# Altium schematic sheet DE-211024_2.SchDoc: RelayBoard
size A4; Author: eldar6776@hotmail.com; DrawnBy: Eldar Dedic; Organization: JUBERA d.o.o.; Address1: Braće Mulić 81; Address2: 71000 Sarajevo; Address3: Federacija BiH; Address4: Bosna i Hercegovina; DocumentNumber: DE-211024; Revision: 001; SheetNumber: 2; SheetTotal: 3; SPICEModelCacheBVBUIEPD: <root> / <DocumentId>BVBUIEPD</DocumentId> / </root>
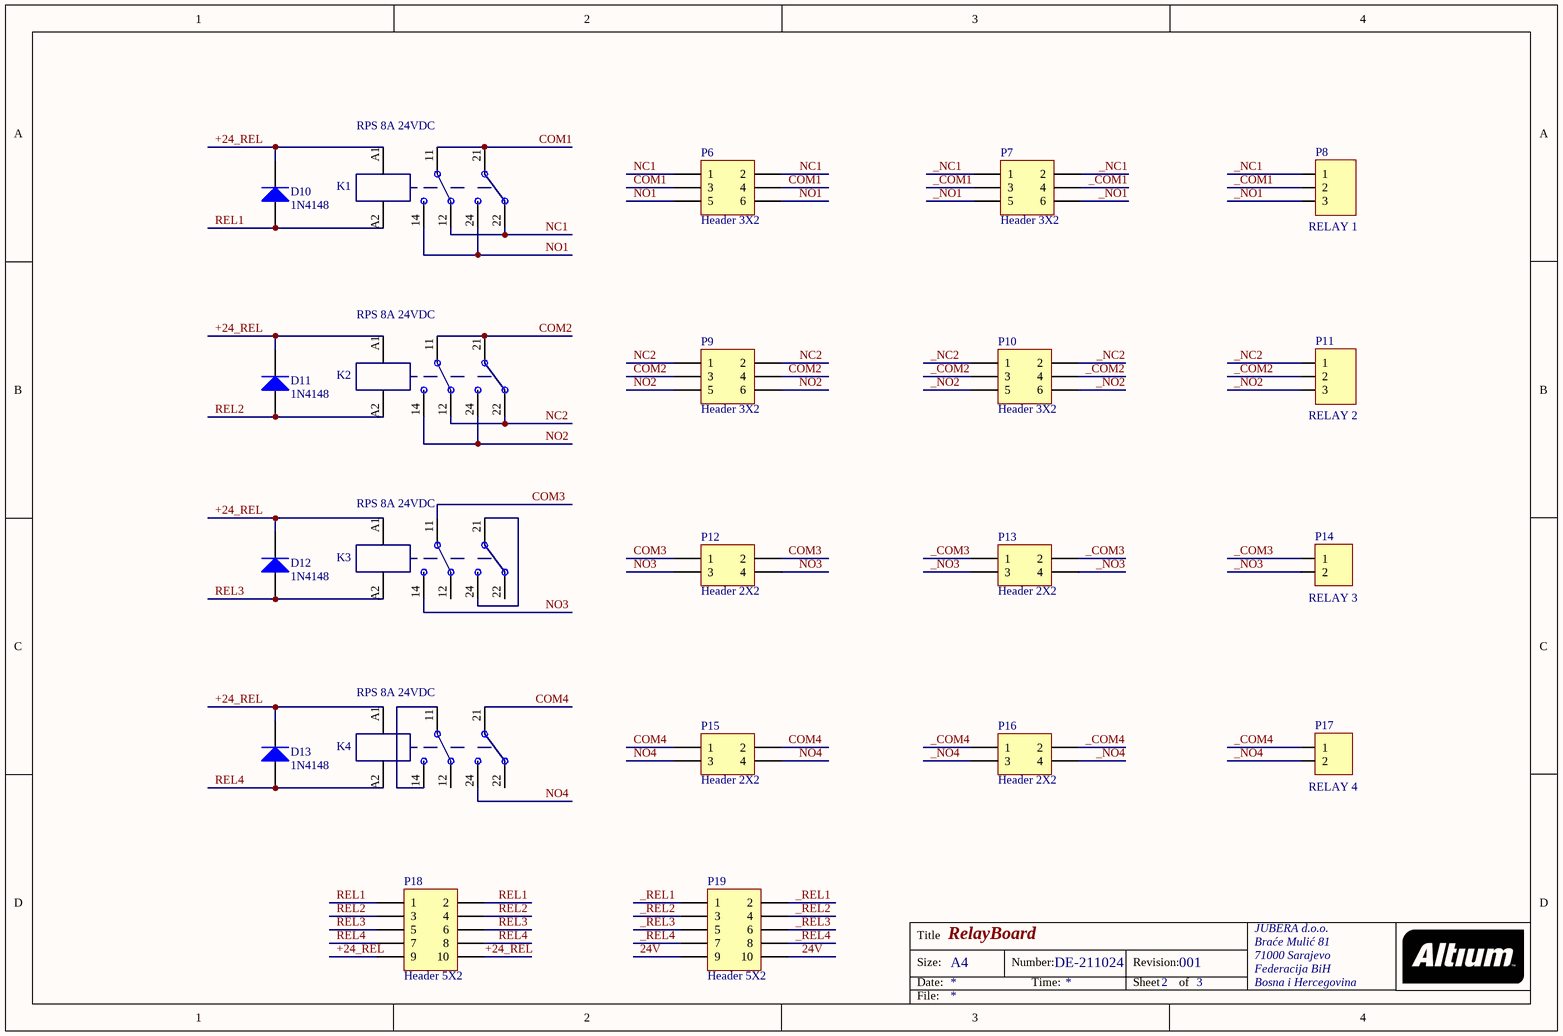
[diagram p0: DE-211024_2.SchDoc]

## Parts
D10  1N4148  [SOD323]
D11  1N4148  [SOD323]
D12  1N4148  [SOD323]
D13  1N4148  [SOD323]
K1  RPS 8A 24VDC  [RPS 2CO 8A 24V]
K2  RPS 8A 24VDC  [RPS 2CO 8A 24V]
K3  RPS 8A 24VDC  [RPS 2CO 8A 24V]
K4  RPS 8A 24VDC  [RPS 2CO 8A 24V]
P6  Header 3X2  [HDR2X3]
P7  Header 3X2  [HDR2X3]
P8  RELAY 1  [TERMINAL BLOK 3]
P9  Header 3X2  [HDR2X3]
P10  Header 3X2  [HDR2X3]
P11  RELAY 2  [TERMINAL BLOK 3]
P12  Header 2X2  [HDR2X2]
P13  Header 2X2  [HDR2X2]
P14  RELAY 3  [TERMINAL BLOK 2]
P15  Header 2X2  [HDR2X2]
P16  Header 2X2  [HDR2X2]
P17  RELAY 4  [TERMINAL BLOK 2]
P18  Header 5X2  [HDR2X5]
P19  Header 5X2  [HDR2X5]

## Nets
24V: P19.9 P19.10
+24_REL: D10.1(K) D11.1(K) D12.1(K) D13.1(K) K1.A1 K2.A1 K3.A1 K4.A1 P18.9 P18.10
_COM1: P7.3 P7.4 P8.2
_COM2: P10.3 P10.4 P11.2
_COM3: P13.1 P13.2 P14.1
_COM4: P16.1 P16.2 P17.1
_NC1: P7.1 P7.2 P8.1
_NC2: P10.1 P10.2 P11.1
_NO1: P7.5 P7.6 P8.3
_NO2: P10.5 P10.6 P11.3
_NO3: P13.3 P13.4 P14.2
_NO4: P16.3 P16.4 P17.2
_REL1: P19.1 P19.2
_REL2: P19.3 P19.4
_REL3: P19.5 P19.6
_REL4: P19.7 P19.8
COM1: K1.11 K1.21 P6.3 P6.4
COM2: K2.11 K2.21 P9.3 P9.4
COM3: K3.11 P12.1 P12.2
COM4: K4.21 P15.1 P15.2
NC1: K1.12 K1.22 P6.1 P6.2
NC2: K2.12 K2.22 P9.1 P9.2
NO1: K1.14 K1.24 P6.5 P6.6
NO2: K2.14 K2.24 P9.5 P9.6
NO3: K3.14 P12.3 P12.4
NO4: K4.24 P15.3 P15.4
REL1: D10.2(A) K1.A2 P18.1 P18.2
REL2: D11.2(A) K2.A2 P18.3 P18.4
REL3: D12.2(A) K3.A2 P18.5 P18.6
REL4: D13.2(A) K4.A2 P18.7 P18.8
NetK3_21: K3.21 K3.24
NetK4_11: K4.11 K4.14

Not connected (* = marked no-connect by the designer): K3 12(5) 22(5); K4 12(5) 22(5)

## Notes on the sheet
- Title
- Size:
- Date:
- A4
- Number:
- Time:
- Revision:
- Sheet
- of
- File:

## Library data of the parts
D10-D13 = BAS321: General-purpose Diode; Published: 17-Sep-2003; LatestRevisionDate: 19-Mar-2004; LatestRevisionNote: Silkscreen size reduced.; DatasheetVersion: 9-Feb-1999; PackageVersion: May-1999; PackageReference: SOD323; Publisher: Altium Limited; PackageDescription: SOD-323/SC-76; 2 Leads; Body 1.7 x 1.3 mm, (LxW); ComponentLink1Description: Manufacturer Link; ComponentLink1URL: http://www.semiconductors.philips.com/; ComponentLink2Description: Datasheet; ComponentLink2URL: http://www.semiconductors.philips.com/acrobat/datasheets/BAS321_2.pdf
K1-K4 = PCB relay 2CO, 8A, 24VDC, RPS serie 5mm
P6 P7 P9 P10 = Header 3X2: Header, 3-Pin, Dual row; LatestRevisionDate: 17-Jul-2002; LatestRevisionNote: Re-released for DXP Platform.; Publisher: Altium Limited
P8 P11 = TERMINAL BLOK 3: 3 pinski terminal blok konektor
P12 P13 P15 P16 = Header 2X2: Header, 2-Pin, Dual row; LatestRevisionDate: 17-Jul-2002; LatestRevisionNote: Re-released for DXP Platform.; Publisher: Altium Limited
P14 P17 = TERMINAL BLOK 2: Terminal blok konektor 3,5 mm
P18 P19 = Header 5X2: Header, 5-Pin, Dual row; LatestRevisionDate: 17-Jul-2002; LatestRevisionNote: Re-released for DXP Platform.; Publisher: Altium Limited